# Altium schematic sheet boxer_pH.SchDoc: Water and Soil pH meter
size A4; DrawnBy: Damian Dolewski; Engineer: Damian Dolewski; DocumentNumber: 3; SheetNumber: 3; SheetTotal: 7
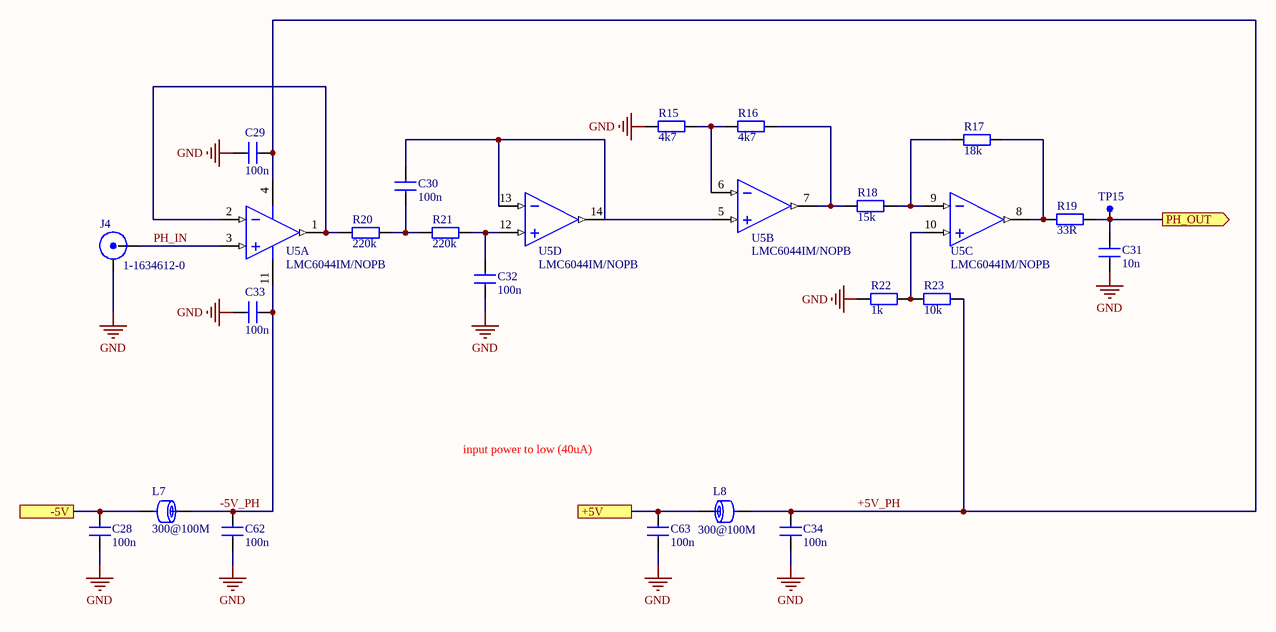
[diagram p0: boxer_pH.SchDoc]

## Parts
C28  value 100n  [C_0805]  (hidden comment: Capacitor)
C29  value 100n  [C_0805]  (hidden comment: Capacitor)
C30  value 100n  [C_0805]  (hidden comment: Capacitor)
C31  value 10n  [C_0805]  (hidden comment: Capacitor)
C32  value 100n  [C_0805]  (hidden comment: Capacitor)
C33  value 100n  [C_0805]  (hidden comment: Capacitor)
C34  value 100n  [C_0805]  (hidden comment: Capacitor)
C62  value 100n  [C_0805]  (hidden comment: Capacitor)
C63  value 100n  [C_0805]  (hidden comment: Capacitor)
J4  1-1634612-0  [1-1634612-0]
L7  value 300@100M  [L_0805]  (hidden comment: 742792031)
L8  value 300@100M  [L_0805]  (hidden comment: 742792031)
R15  value 4k7  [R_0805]  (hidden comment: Resistor)
R16  value 4k7  [R_0805]  (hidden comment: Resistor)
R17  value 18k  [R_0805]  (hidden comment: Resistor)
R18  value 15k  [R_0805]  (hidden comment: Resistor)
R19  value 33R  [R_0805]  (hidden comment: Resistor)
R20  value 220k  [R_0805]  (hidden comment: Resistor)
R21  value 220k  [R_0805]  (hidden comment: Resistor)
R22  value 1k  [R_0805]  (hidden comment: Resistor)
R23  value 10k  [R_1206]  (hidden comment: Resistor)
TP15  TEST PAD  [PIN]  (value not drawn)
U5  LMC6044IM/NOPB  [SO14]  (parts A,B,C,D of 4)

## Ports
+5V, -5V, PH_OUT (out)

## Nets
GND: C28.1 C29.1 C31.1 C32.1 C33.1 C34.1 C62.1 C63.1 J4.2(GND) R15.1 R22.1
+5V: C63.2 L8.1 ; port +5V
+5V_PH: C29.2 C34.2 L8.2 R23.2 U5.4(VCC+)
-5V: C28.2 L7.2 ; port -5V
-5V_PH: C33.2 C62.2 L7.1 U5.11(VCC-)
PH_IN: J4.1(OUT) U5.3(IN+)
PH_OUT: C31.2 R19.2 TP15.1 ; port PH_OUT
NetC30_1: C30.1 R20.2 R21.1
NetC30_2: C30.2 U5.5(IN+) U5.13(IN-) U5.14(OUT)
NetC32_2: C32.2 R21.2 U5.12(IN+)
NetR15_2: R15.2 R16.1 U5.6(IN-)
NetR16_2: R16.2 R18.1 U5.7(OUT)
NetR17_1: R17.1 R18.2 U5.9(IN-)
NetR17_2: R17.2 R19.1 U5.8(OUT)
NetR20_1: R20.1 U5.1(OUT) U5.2(IN-)
NetR22_2: R22.2 R23.1 U5.10(IN+)

## Notes on the sheet
- input power to low (40uA)
- Title:
- Size:
- A4
- Number:
- Revision:
- Date:
- File:
- Sheet
- of

## Library data of the parts
J4 = BNC: BNC Elbow Connector; Value: 1-1634612-0
L7 L8 = FB: Ferrite Bead
TP15 = TEST_PAD: PAD 1.5mm
U5 = LMC6044IM/NOPB: CMOS Quad Micropower Operational Amplifier, 14-pin Narrow SOIC; Value: LMC6044IM/NOPB